# EAGLE design power (EAGLE 6.1)
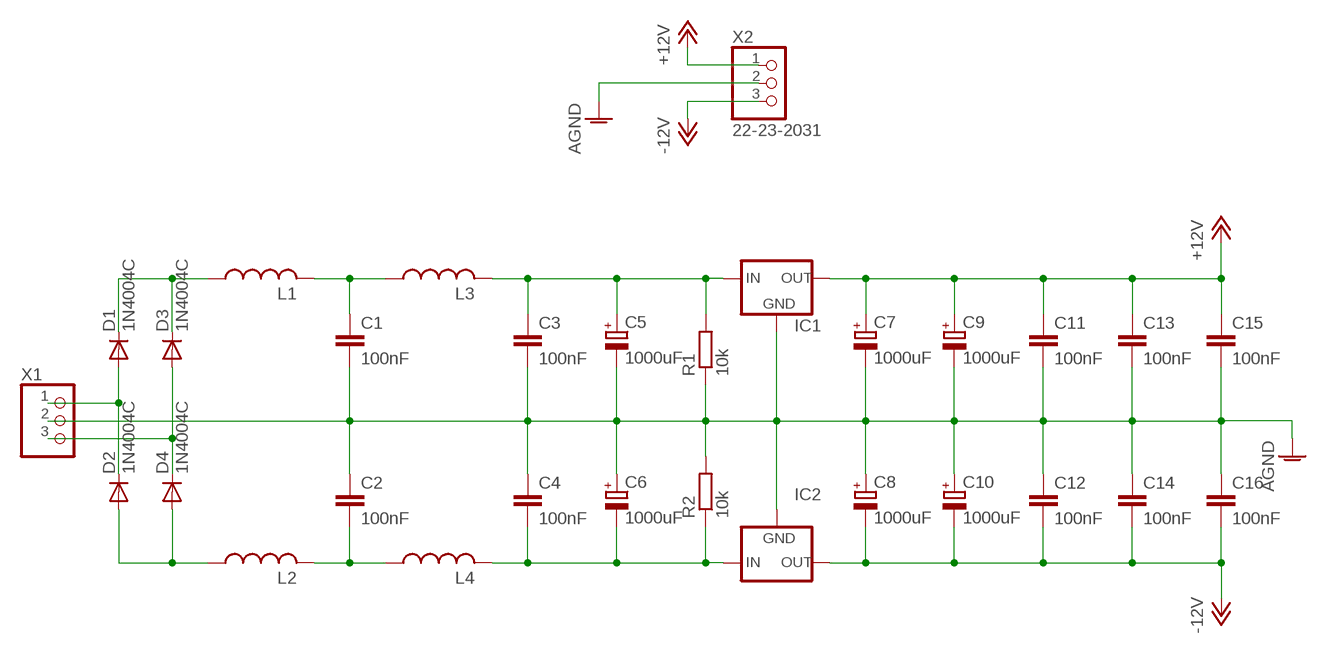
[diagram p0: schematic, sheet 1]

## Parts
C1  100nF  C-EU050-045X075  [C050-045X075]
C2  100nF  C-EU050-045X075  [C050-045X075]
C3  100nF  C-EU050-045X075  [C050-045X075]
C4  100nF  C-EU050-045X075  [C050-045X075]
C5  1000uF  CPOL-EUE5-13  [E5-13]
C6  1000uF  CPOL-EUE5-13  [E5-13]
C7  1000uF  CPOL-EUE5-13  [E5-13]
C8  1000uF  CPOL-EUE5-13  [E5-13]
C9  1000uF  CPOL-EUE5-13  [E5-13]
C10  1000uF  CPOL-EUE5-13  [E5-13]
C11  100nF  C-EU050-045X075  [C050-045X075]
C12  100nF  C-EU050-045X075  [C050-045X075]
C13  100nF  C-EU050-045X075  [C050-045X075]
C14  100nF  C-EU050-045X075  [C050-045X075]
C15  100nF  C-EU050-045X075  [C050-045X075]
C16  100nF  C-EU050-045X075  [C050-045X075]
D1  1N4004C  [DO41-10]
D2  1N4004C  [DO41-10]
D3  1N4004C  [DO41-10]
D4  1N4004C  [DO41-10]
IC1  78XXTO-220  [78XXS]
IC2  79XXTO-220  [79XXS]
L1  L-US075-063X106  [L075-063X106]
L2  L-US075-063X106  [L075-063X106]
L3  L-US075-063X106  [L075-063X106]
L4  L-US075-063X106  [L075-063X106]
R1  10k  R-EU_0207/2V  [0207/2V]
R2  10k  R-EU_0207/2V  [0207/2V]
X1  W237-103  [W237-103]
X2  22-23-2031  [22-23-2031]

## Nets
+12V: C7.+ C9.+ C11.1 C13.1 C15.1 IC1.OUT X2.1
-12V: C8.- C10.- C12.2 C14.2 C16.2 IC2.OUT X2.3
AGND: C1.2 C2.1 C3.2 C4.1 C5.- C6.+ C7.- C8.+ C9.- C10.+ C11.2 C12.1 C13.2 C14.1 C15.2 C16.1 IC1.GND IC2.GND R1.1 R2.2 X1.2 X2.2
N$1: C1.1 L1.2 L3.1
N$2: C2.2 L2.2 L4.1
N$4: C3.1 C5.+ IC1.IN L3.2 R1.2
N$5: C4.2 C6.- IC2.IN L4.2 R2.1
N$17: D2.A D4.A L2.1
N$19: D1.C D3.C L1.1
N$21: D1.A D2.C X1.1
N$22: D3.A D4.C X1.3

## Library data of the parts
C1-C4 C11-C16 = amp:C-EU: CAPACITOR, European symbol
C5-C10 = amp:CPOL-EU: POLARIZED CAPACITOR, European symbol
D1-D4 = amp:1N4004: DIODE general purpose rectifier, 1 A
IC1 = amp:78XX: VOLTAGE REGULATOR
IC2 = amp:79XX: VOLTAGE REGULATOR
L1-L4 = amp:L-US: INDUCTOR, American symbol
R1 R2 = amp:R-EU_: RESISTOR, European symbol
X1 = amp:W237-103: WAGO SCREW CLAMP
X2 = amp:22-23-2031: .100" (2.54mm) Center Header - 3 Pin

## Board
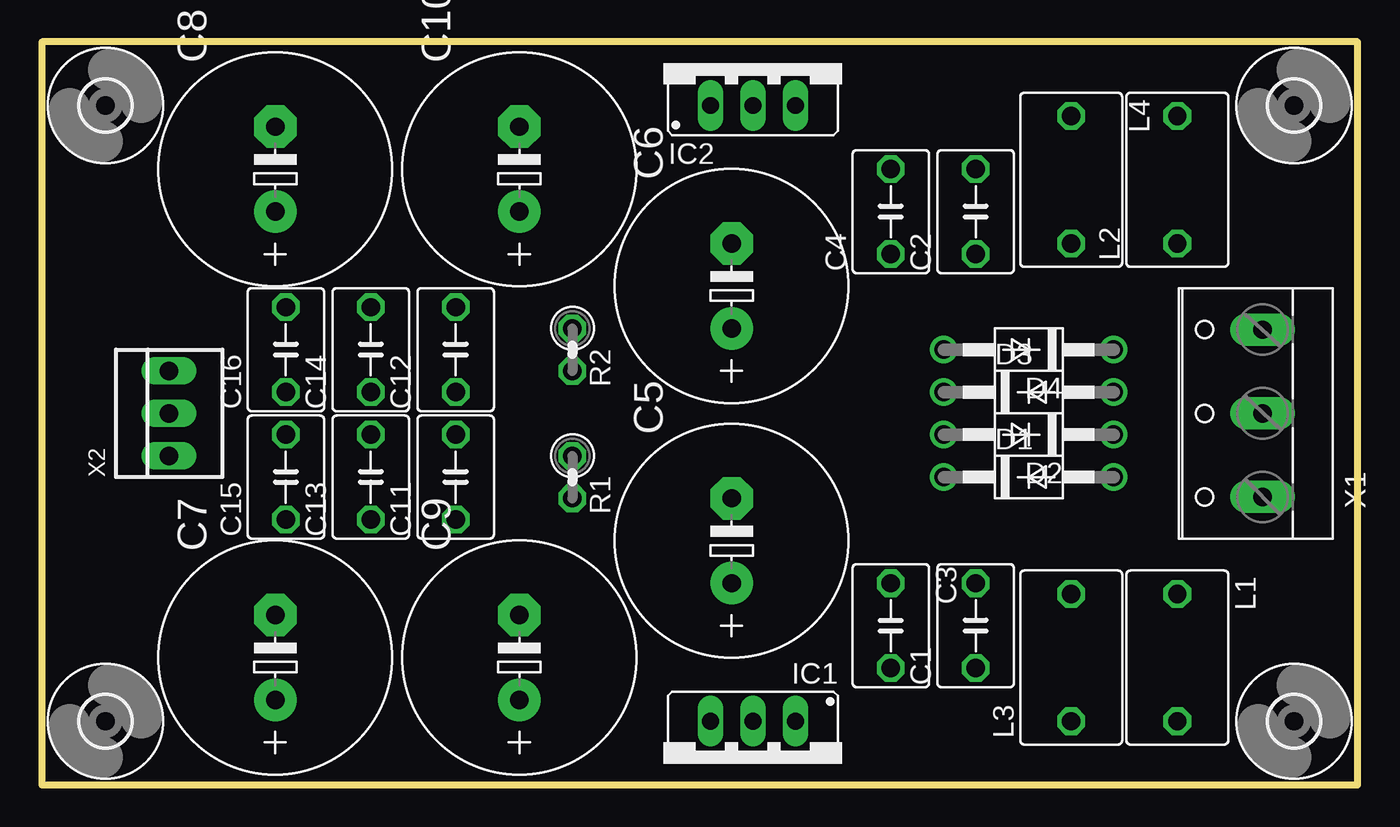
[diagram p1: board, top side]
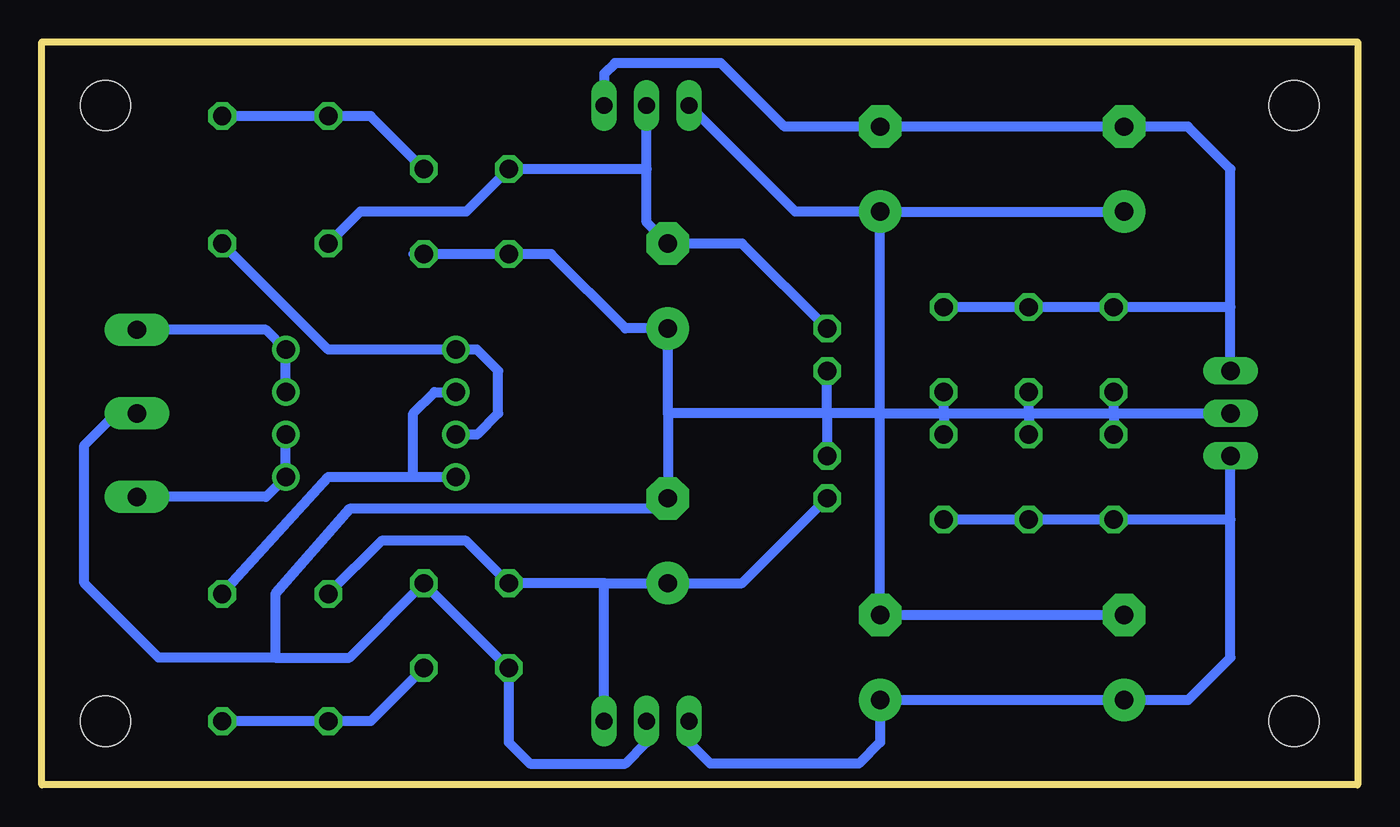
[diagram p2: board, bottom side, seen from below]

Size 78.74 x 44.45 mm. Coordinates in mm from the lower left corner, seen from the top.
Outline: 0,44.45 0,0 78.74,0 78.74,44.45 0,44.45
Copper layers (1*16): Top 0.035mm / dielectric 1.5mm / Bottom 0.035mm
Design rules: minimum track width 10mil, minimum drill 24mil, track to track 8mil, track to pad 8mil, pad to pad 8mil, via to via 8mil, smd to smd 8mil, copper to edge 40mil, drill to drill 8mil, minimum pad ring 10mil, minimum via ring 8mil, stop-mask expansion 4mil, vias tented up to drill 0mil, thermal gap 10mil

### Footprints (pad centres in the part's own frame; a part is rotated, then mirrored left to right if it is on the bottom)
C050-045X075 = drill 1.1 octagon: 1 -2.54,0; 2 2.54,0
E5-13 = drill 1.1 pad 2.54: + -2.54,0 | drill 1.1 pad 2.54 octagon: - 2.54,0
DO41-10 = drill 1.1: A 5.08,0; C -5.08,0
78XXS = drill 1.016 long: GND 0,-2.54; IN -2.54,-2.54; OUT 2.54,-2.54
79XXS = drill 1.016 long: GND -2.54,-2.54; IN 0,-2.54; OUT 2.54,-2.54
L075-063X106 = drill 1.1 octagon: 1 -3.81,0; 2 3.81,0
0207/2V = drill 1.1 octagon: 1 -1.27,0; 2 1.27,0
3,0 = hole 3: 0,0
W237-103 = drill 1.1 pad 1.93 long: 1 -5,-1.29; 2 0,-1.29; 3 5,-1.29
22-23-2031 = drill 1.1 long: 1 -2.54,0; 2 0,0; 3 2.54,0

### Placement (x,y rotation side)
C1  55.88,9.53 90 top
C2  55.88,34.29 90 top
C3  50.8,9.53 270 top
C4  50.8,34.29 90 top
C5  41.27,14.61 90 top
C6  41.27,29.84 90 top
C7  13.97,7.62 90 top
C8  13.97,36.83 90 top
C9  28.57,7.62 90 top
C10  28.57,36.83 90 top
C11  24.77,18.41 90 top
C12  24.77,26.04 90 top
C13  19.68,18.41 90 top
C14  19.68,26.04 90 top
C15  14.61,18.41 90 top
C16  14.61,26.04 90 top
D1  59.05,18.41 0 top
D2  59.05,20.95 180 top
D3  59.05,23.5 0 top
D4  59.05,26.04 180 top
IC1  42.55,1.27 180 top
IC2  42.55,43.18 0 top
L1  67.94,7.62 270 top
L2  67.94,36.2 90 top
L3  61.59,7.62 90 top
L4  61.59,36.2 270 top
R1  31.75,18.41 270 top
R2  31.75,26.04 270 top
U$1  [3,0]  3.81,3.81 180 top
U$2  [3,0]  3.81,40.64 180 top
U$3  [3,0]  74.93,40.64 180 top
U$4  [3,0]  74.93,3.81 180 top
X1  71.75,22.23 90 top
X2  7.62,22.23 90 top

### Tracks (layer width: path | path; a pad name or v marks a point on that pad's centre or on a via)
+12V
  Bottom 0.61: C11.1 C13.1 C15.1 7.62,15.88 | 7.62,15.88 X2.1 | 7.62,15.88 7.62,7.62 10.16,5.08 C7.+ C9.+ 28.57,2.54 29.84,1.27 37.47,1.27 38.73,1.27 40.01,2.54 IC1.OUT
-12V
  Bottom 0.61: C12.2 C14.2 C16.2 7.62,28.57 | X2.3 7.62,28.57 | 7.62,28.57 7.62,36.83 10.16,39.37 C8.- C10.- 34.29,39.37 38.1,43.18 44.45,43.18 45.09,42.55 IC2.OUT
AGND
  Bottom 0.61: 41.27,22.23 C6.+ 43.81,27.3 48.26,31.75 C4.1 C2.1 56.52,31.75 | 41.27,22.23 C5.- 41.91,16.51 60.33,16.51 64.77,11.43 64.77,7.62 | X1.2 74.3,22.23 76.2,20.32 76.2,12.06 71.75,7.62 64.77,7.62 | 31.75,22.23 41.27,22.23 | 31.75,22.23 R2.2 | 31.75,22.23 R1.1 | 28.57,22.23 31.75,22.23 | 28.57,22.23 C10.+ | 28.57,22.23 24.77,22.23 | 24.77,22.23 C12.1 | 24.77,22.23 C11.2 | 24.77,22.23 19.68,22.23 | 19.68,22.23 C14.1 | 19.68,22.23 C13.2 | 19.68,22.23 14.61,22.23 | 14.61,22.23 C16.1 | 14.61,22.23 C15.2 | C10.+ C8.+ | 64.77,7.62 60.33,7.62 C1.2 C3.2 50.8,2.54 49.53,1.27 43.81,1.27 42.55,2.54 IC1.GND | C10.+ 33.66,34.29 IC2.GND | 28.57,22.23 C9.- C7.- | 14.61,22.23 X2.2
N$1
  Bottom 0.61: L1.2 L3.1 59.05,3.81 C1.1
N$2
  Bottom 0.61: L2.2 L4.1 59.05,40.01 C2.2
N$4
  Bottom 0.61: 45.09,12.06 C5.+ 36.83,12.06 R1.2 | 45.09,12.06 C3.1 53.34,14.61 58.42,14.61 L3.2 | IC1.IN 45.09,12.06
N$5
  Bottom 0.61: R2.1 36.83,32.38 C6.- 42.55,33.66 42.55,36.83 | 42.55,36.83 IC2.IN | 42.55,36.83 C4.2 53.34,34.29 59.69,34.29 L4.2
N$17
  Bottom 0.61: L2.1 61.59,26.04 D4.A 52.7,26.04 51.44,24.77 51.44,22.23 52.7,20.95 D2.A
N$19
  Bottom 0.61: L1.1 61.59,18.41 56.52,18.41 | D1.C 56.52,18.41 | D3.C 55.24,23.5 56.52,22.23 56.52,18.41
N$21
  Bottom 0.61: X1.1 65.33,17.23 D1.A D2.C
N$22
  Bottom 0.61: X1.3 65.33,27.23 D4.C D3.A